# Altium schematic sheet 日原理图.SchDoc
size A2
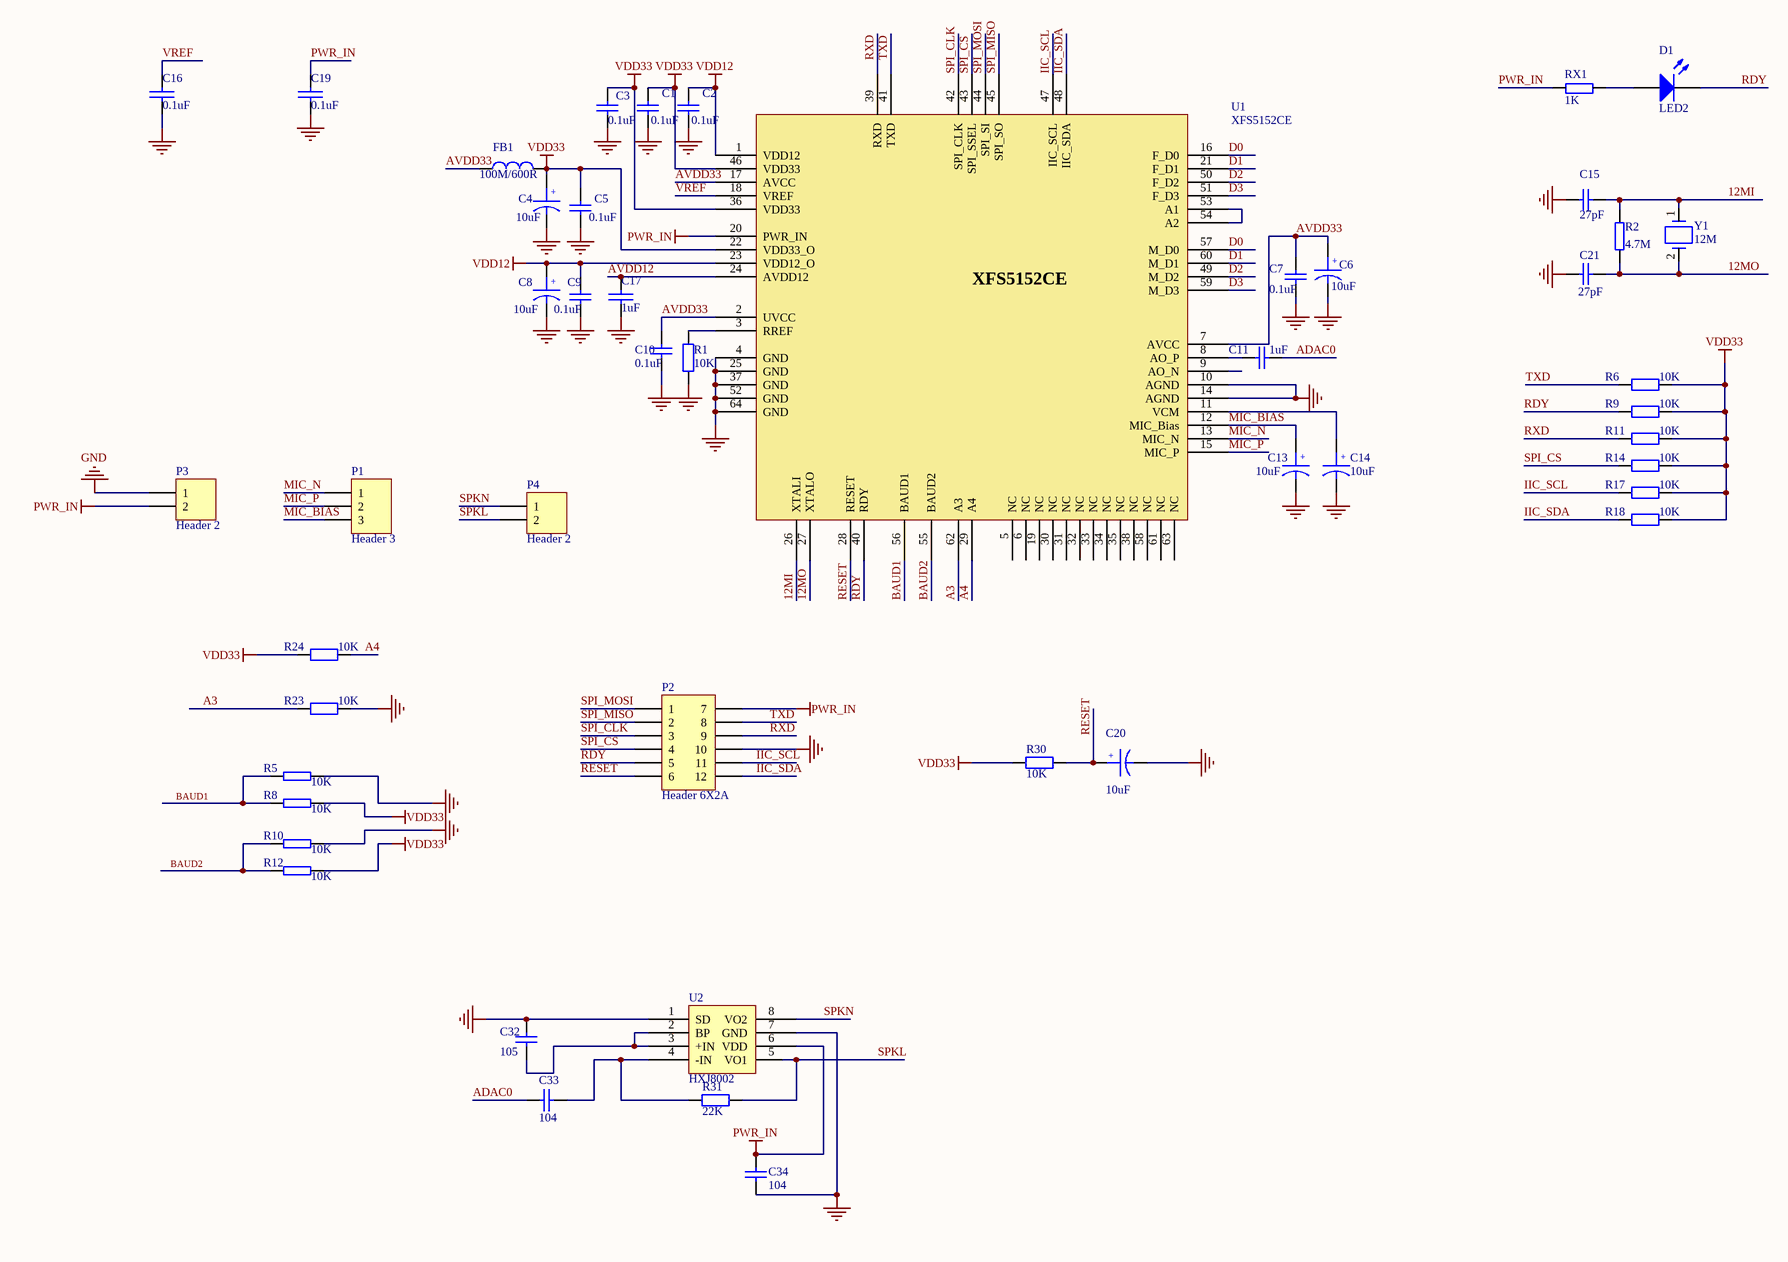
[diagram p0: 日原理图.SchDoc]

## Parts
C1  0.1uF  [0603P]
C2  0.1uF  [0603P]
C3  0.1uF  [0603P]
C4  10uF  [0805]
C5  0.1uF  [0603P]
C6  10uF  [0805]
C7  0.1uF  [0603P]
C8  10uF  [0805]
C9  0.1uF  [0603P]
C10  0.1uF  [0603P]
C11  1uF  [0603P]
C13  10uF  [0805]
C14  10uF  [0805]
C15  27pF  [0603P]
C16  0.1uF  [0603P]
C17  1uF  [0603P]
C19  0.1uF  [0603P]
C20  10uF  [0603P]
C21  27pF  [0603P]
C32  105  [0603P]
C33  104  [0603P]
C34  104  [0603P]
D1  LED2  [3.2X1.6X1.1]
FB1  100M/600R  [0603P]
P1  Header 3  [HDR1X3]
P2  Header 6X2A  [HDR2X6_CEN]
P3  Header 2  [HDR1X2]
P4  Header 2  [HDR1X2]
R1  10K  [0603P]
R2  4.7M  [R0603]
R5  10K  [R0603]
R6  10K  [R0603]
R8  10K  [R0603]
R9  10K  [R0603]
R10  10K  [R0603]
R11  10K  [R0603]
R12  10K  [R0603]
R14  10K  [R0603]
R17  10K  [R0603]
R18  10K  [R0603]
R23  10K  [R0603]
R24  10K  [R0603]
R30  10K  [R0603]
R31  22K  [R0603]
RX1  1K  [0603P]
U1  XFS5152CE  [LQFP64]
U2  HXJ8002  [SOP-8]
Y1  12M  [XTAL_US]

## Nets
GND: C1.1 C2.1 C3.1 C4.2 C5.1 C6.2 C7.1 C8.2 C9.1 C10.1 C13.2 C14.2 C15.1 C16.2 C17.2 C19.2 C20.2 C21.1 C32.2 C34.2 P2.10 P3.1 R1.1 R5.1 R10.1 R23.1 U1.4(GND) U1.10(AGND) U1.14(AGND) U1.25(GND) U1.37(GND) U1.52(GND) U1.64(GND) U2.1(SD) U2.7(GND)
PWR_IN: C19.1 C34.1 P2.7 P3.2 RX1.1 U1.20(PWR_IN) U2.6(VDD)
VDD12: C2.2 C8.1 C9.2 U1.1(VDD12) U1.23(VDD12_O)
VDD33: C1.2 C3.2 C4.1 C5.2 FB1.2 R6.1 R8.1 R9.1 R11.1 R12.2 R14.1 R17.1 R18.1 R24.2 R30.1 U1.22(VDD33_O) U1.36(VDD33) U1.46(VDD33)
12MI: C15.2 R2.1 U1.26(XTALI) Y1.1
12MO: C21.2 R2.2 U1.27(XTALO)
A3: R23.2 U1.62(A3)
A4: R24.1 U1.29(A4)
ADAC0: C11.1 C33.2
AVDD12: C17.1 U1.24(AVDD12)
AVDD33: C6.1 C7.2 C10.2 FB1.1 U1.2(UVCC) U1.7(AVCC) U1.17(AVCC)
BAUD1: R5.2 R8.2 U1.56(BAUD1)
BAUD2: R10.2 R12.1 U1.55(BAUD2)
D0: U1.16(F_D0) U1.57(M_D0)
D1: U1.21(F_D1) U1.60(M_D1)
D2: U1.49(M_D2) U1.50(F_D2)
D3: U1.51(F_D3) U1.59(M_D3)
IIC_SCL: P2.11 R17.2 U1.47(IIC_SCL)
IIC_SDA: P2.12 R18.2 U1.48(IIC_SDA)
MIC_BIAS: C13.1 P1.3 U1.12(MIC_Bias)
MIC_N: P1.1 U1.13(MIC_N)
MIC_P: P1.2 U1.15(MIC_P)
RDY: D1.2(K) P2.5 R9.2 U1.40(RDY)
RESET: C20.1 P2.6 R30.2 U1.28(RESET)
RXD: P2.9 R11.2 U1.39(RXD)
SPI_CLK: P2.3 U1.42(SPI_CLK)
SPI_CS: P2.4 R14.2 U1.43(SPI_SSEL)
SPI_MISO: P2.2 U1.45(SPI_SO)
SPI_MOSI: P2.1 U1.44(SPI_SI)
SPKL: P4.2 R31.2 U2.5(VO1)
SPKN: P4.1 U2.8(VO2)
TXD: P2.8 R6.2 U1.41(TXD)
VREF: C16.1 U1.18(VREF)
NetC11_2: C11.2 U1.8(AO_P)
NetC14_1: C14.1 U1.11(VCM)
NetC32_1: C32.1 U2.2(BP) U2.3(+IN)
NetC33_1: C33.1 R31.1 U2.4(-IN)
NetD1_1: D1.1(A) RX1.2
NetR1_2: R1.2 U1.3(RREF)
NetU1_53: U1.53(A1) U1.54(A2)

Not connected (* = marked no-connect by the designer): U1 5(NC) 6(NC) 9(AO_N) 19(NC) 30(NC) 31(NC) 32(NC) 33(NC) 34(NC) 35(NC) 38(NC) 58(NC) 61(NC) 63(NC); Y1 2

## Notes on the sheet
- (in symbol CAP POL) +

## Library data of the parts
C1-C3 C5 C7 C9-C11 C15 C21 C32-C34 = Cap NP: 电容; Published: 8-Jun-2000; LatestRevisionDate: 17-Jul-2002; LatestRevisionNote: Re-released for DXP Platform.; Publisher: Altium Limited
C4 C6 C8 C13 C14 C20 = CAP POL: Part package: 6032
C16 C17 C19 = CAP: Capacitor
D1 = LED2: Typical RED, GREEN, YELLOW, AMBER GaAs LED; Published: 8-Jun-2000; LatestRevisionDate: 17-Jul-2002; LatestRevisionNote: Re-released for DXP Platform.; PackageVersion: Feb-2002; PackageReference: 3.2X1.6X1.1; Publisher: Altium Limited; PackageDescription: SM LED; 2 Flat Leads
FB1 = Fbead: 磁珠; Code_IEC: 1005; Published: 8-Jun-2000; LatestRevisionDate: 17-Jul-2002; LatestRevisionNote: Re-released for DXP Platform.; PackageReference: 0402-A; Publisher: Altium Limited; Code_JEITA: 0402
P1 = Header 3: Header, 3-Pin; LatestRevisionDate: 17-Jul-2002; LatestRevisionNote: Re-released for DXP Platform.; Publisher: Altium Limited
P2 = Header 6X2A: Header, 6-Pin, Dual row; LatestRevisionDate: 17-Jul-2002; LatestRevisionNote: Re-released for DXP Platform.; Publisher: Altium Limited
P3 P4 = Header 2: Header, 2-Pin; LatestRevisionDate: 17-Jul-2002; LatestRevisionNote: Re-released for DXP Platform.; Publisher: Altium Limited
R1 R6 R9 R11 R14 R17 R18 R23 R24 R30 R31 = Res2: Resistor; Published: 8-Jun-2000; LatestRevisionDate: 17-Jul-2002; LatestRevisionNote: Re-released for DXP Platform.; Publisher: Altium Limited
  R1: PackageReference: AXIAL-0.4; Value: 10K
R2 R5 R8 R10 R12 = RES2: 电阻
RX1 = R
U1 = XFS5152-2
Y1 = XTAL1: 晶振